# EAGLE design IN17BOARD_Control (EAGLE 7.1.0)
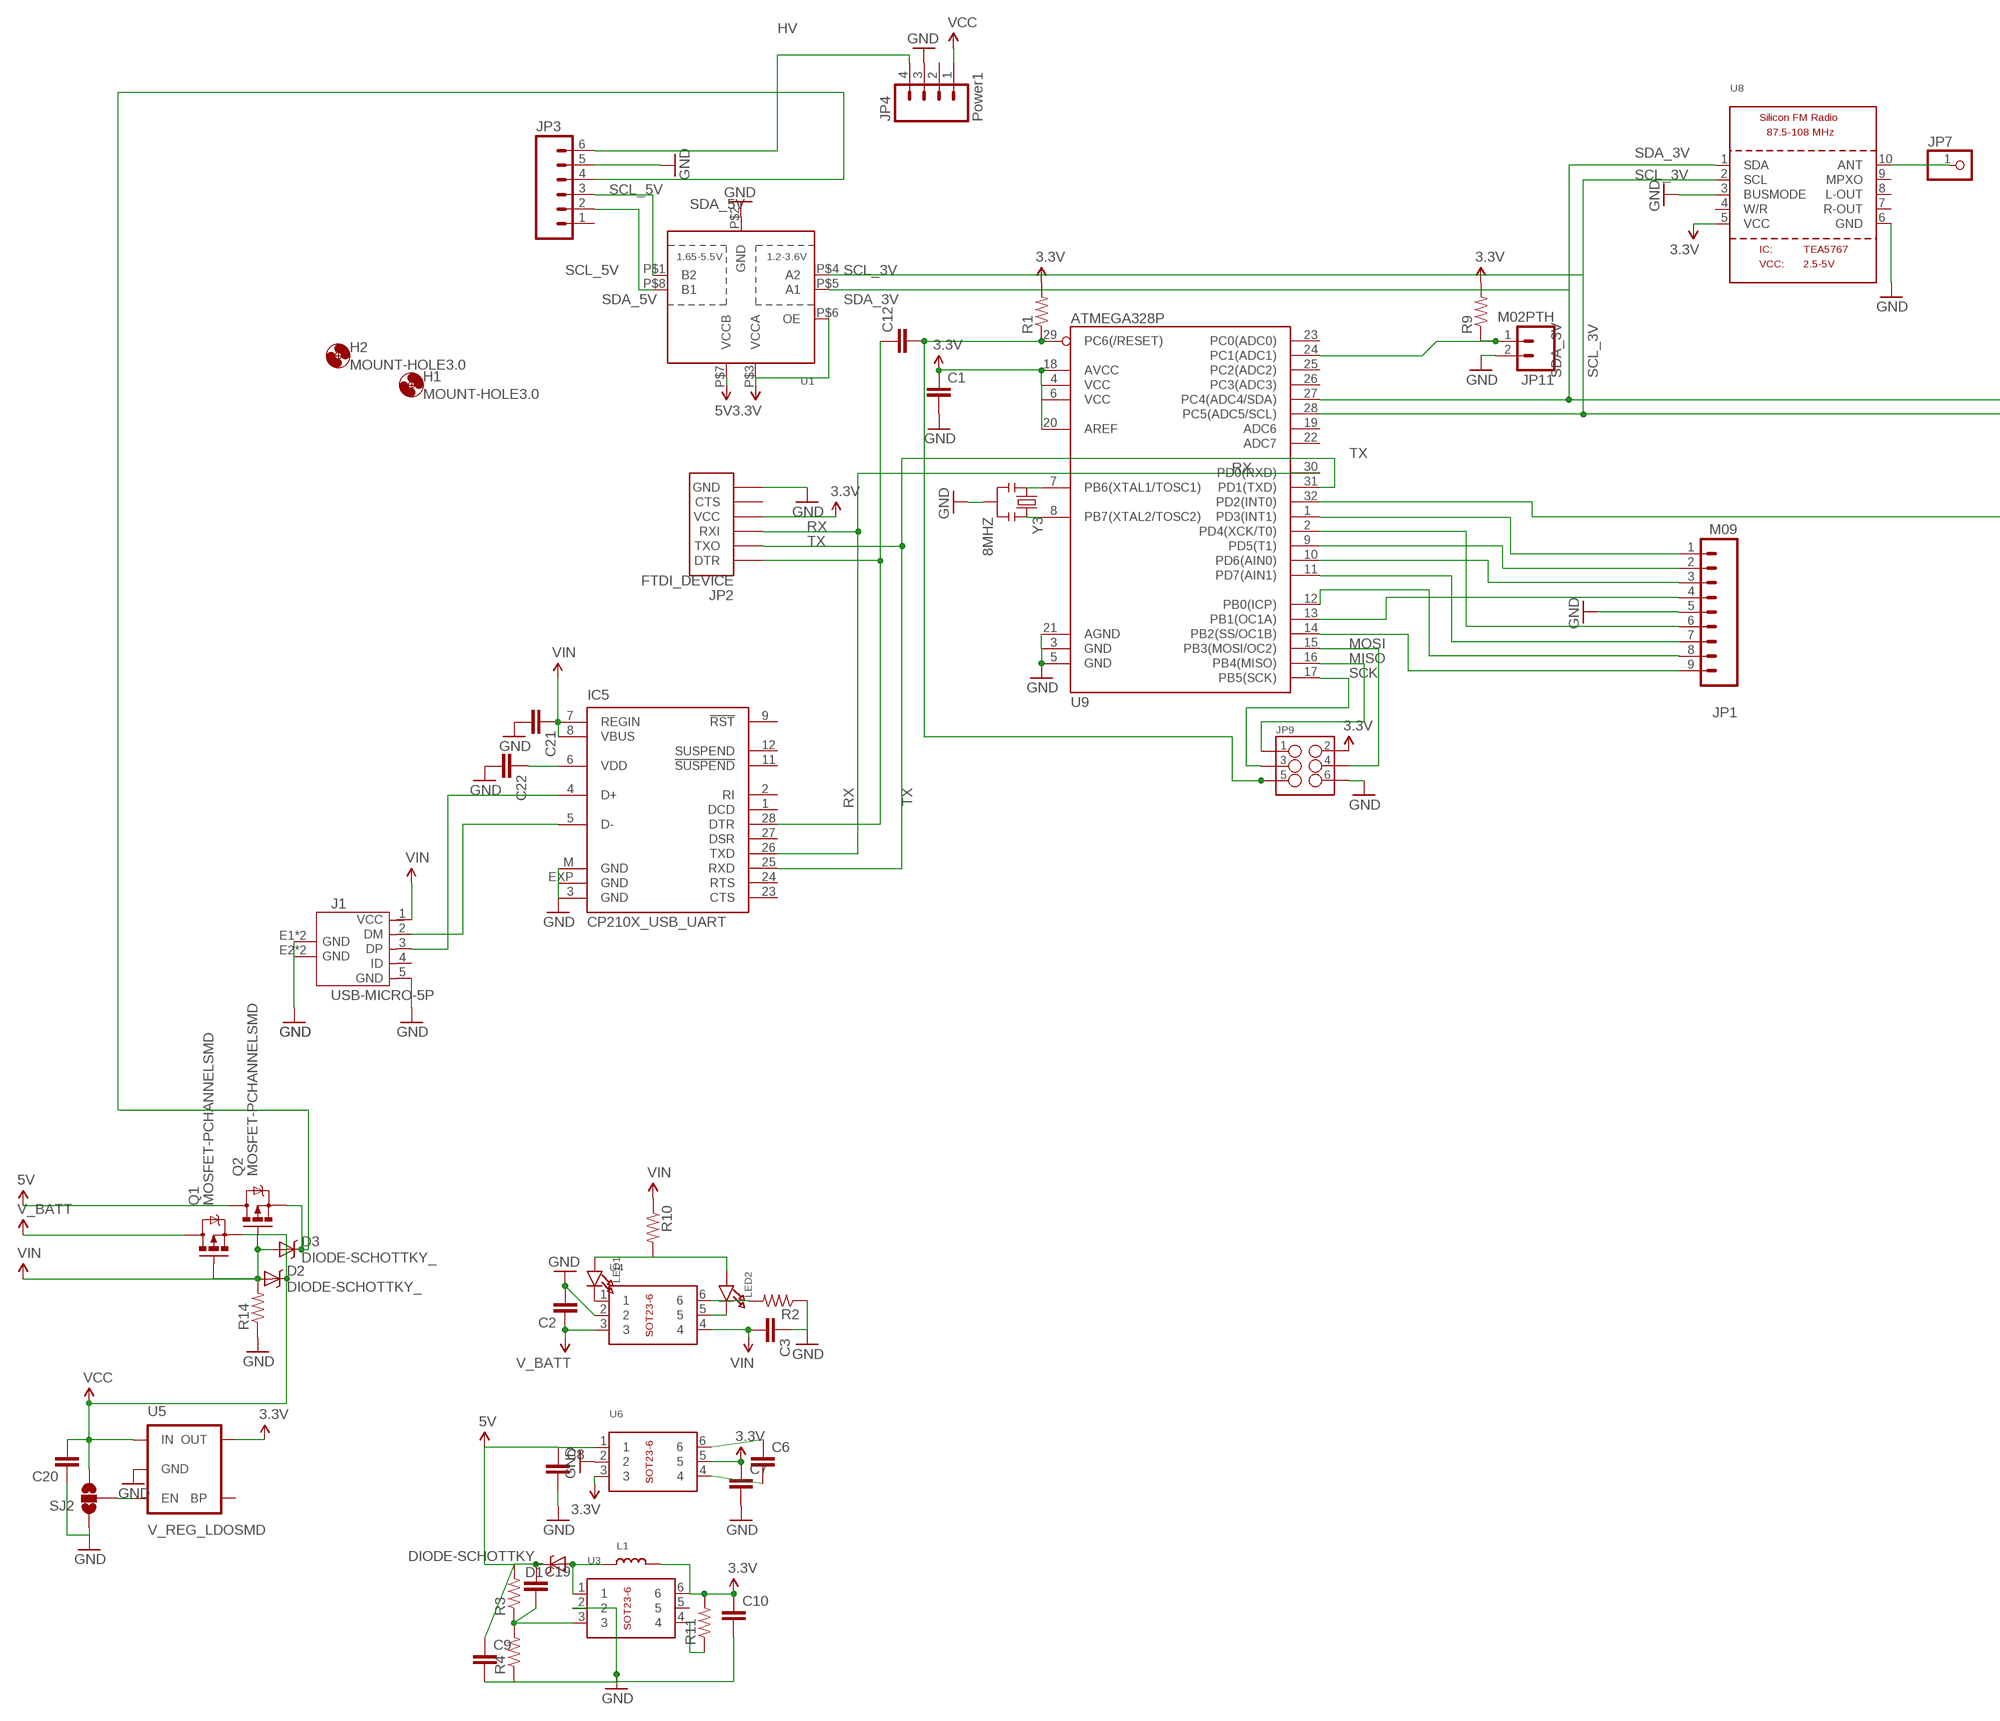
[diagram p0: schematic, sheet 1, part 1 of 2]
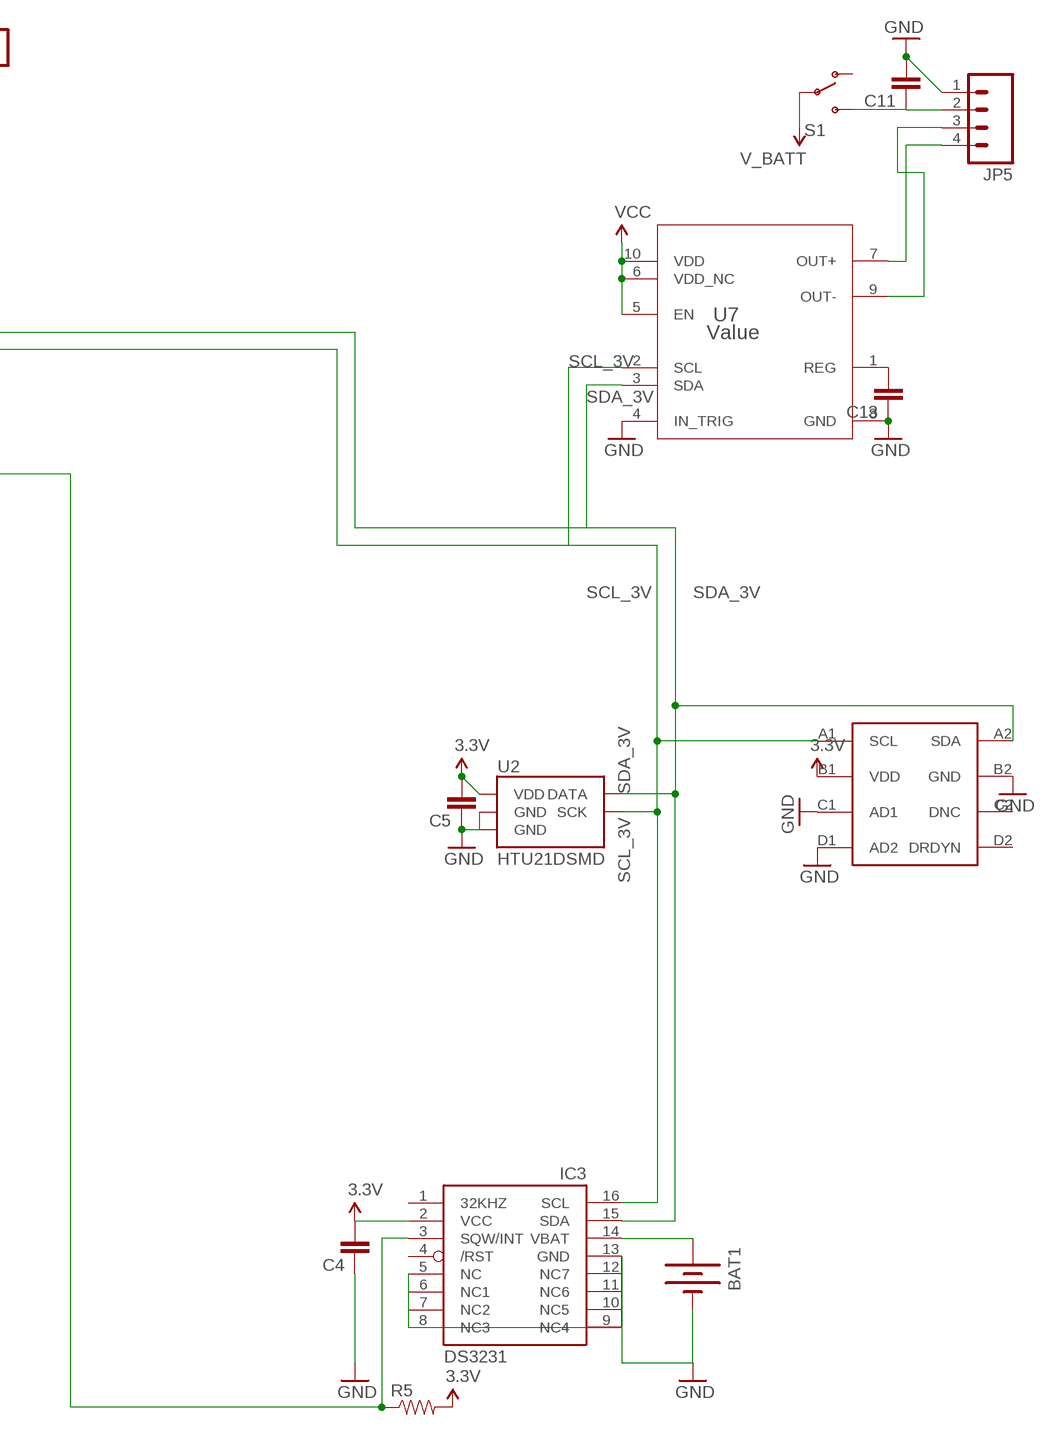
[diagram p1: schematic, sheet 1, part 2 of 2]

## Parts
BAT1  BATTERY12PTH  [BATTCON_12MM_PTH]
C1  CAP0805  [0805]
C2  CAP0805  [0805]
C3  CAP0805  [0805]
C4  CAP0805  [0805]
C5  CAP0805  [0805]
C6  CAP0805  [0805]
C7  CAP0805  [0805]
C8  CAP0805  [0805]
C9  CAP0805  [0805]
C10  CAP0805  [0805]
C11  CAP0805  [0805]
C12  CAP0805  [0805]
C13  CAP0805  [0805]
C19  CAP0805  [0805]
C20  CAP0805  [0805]
C21  CAP0805  [0805]
C22  CAP0805  [0805]
D1  DIODE-SCHOTTKY_  [SMA-DIODE]
D2  DIODE-SCHOTTKY_  [SMA-DIODE]
D3  DIODE-SCHOTTKY_  [SMA-DIODE]
H1  MOUNT-HOLE3.0  [3,0]
H2  MOUNT-HOLE3.0  [3,0]
IC3  DS3231/SO  [SO16W]
IC5  CP210X_USB_UART  [MLP28]
J1  USB-MICRO-5P  [MICRO-USB-5P]
JP1  M09  [1X09]
JP2  FTDI_DEVICE  [FTDI_DEVICE_SIDE]
JP3  M06SIP  [1X06]
JP4  Power1  M04LOCK  [1X04_LOCK]
JP5  M041.27MM  [1X04-1.27MM]
JP7  HEADER-1X1ROUND  [1X01_ROUND]
JP9  M03X22X3_SILK_SM  [2X3]
JP11  M02PTH  [1X02]
L1  INDUCTOR  [INDUCTOR_1007]
LED1  LED0603_NOOUTLINE  [CHIPLED_0603_NOOUTLINE]
LED2  LED0603_NOOUTLINE  [CHIPLED_0603_NOOUTLINE]
Q1  MOSFET-PCHANNELSMD  [SOT23-3]
Q2  MOSFET-PCHANNELSMD  [SOT23-3]
R1  RESISTOR0805-RES  [0805]
R2  RESISTOR0805-RES  [0805]
R3  RESISTOR0805-RES  [0805]
R4  RESISTOR0805-RES  [0805]
R5  RESISTOR0805-RES  [0805]
R9  RESISTOR0805-RES  [0805]
R10  RESISTOR0805-RES  [0805]
R11  RESISTOR0805-RES  [0805]
R14  RESISTOR0805-RES  [0805]
S1  SWITCH-SPDT-SMD-A  [SWITCH-SPST-SMD-A]
SJ2  SOLDERJUMPER_2WAYS  [SJ_3]
U1  TXS0102  [VFSOP-8]
U2  HTU21DSMD  [HTU21D]
U3  BREAKOUT_SOT23-6  [BREAKOUT_SOT23-6]
U4  BREAKOUT_SOT23-6  [BREAKOUT_SOT23-6]
U5  V_REG_LDOSMD  [SOT23-5]
U6  BREAKOUT_SOT23-6  [BREAKOUT_SOT23-6]
U7  Value  DRV2604LDGSR  [DGS0010A]
U8  TEA5767MODULE  [TEA5767MODULE]
U9  ATMEGA328P  ATMEGA328_SMT  [TQFP32-08]
U$1  HDC1000  [BGA]
Y3  8MHZ  RESONATOR8MHZ  [RESONATOR-SMD]

## Nets
3.3V [Power]: C1.1 C4.2 C5.2 C7.1 C10.1 C22.1 IC3.2(VCC) IC5.6(VDD) JP2.P$4(VCC) JP9.2 L1.P$2 R1.2 R5.2 R9.2 R11.2 U1.P$3(VCCA) U1.P$6(OE) U2.VDD U3.6 U5.5(OUT) U6.3 U6.5 U8.5(VCC) U9.4(VCC) U9.6(VCC) U9.18(AVCC) U9.20(AREF) U$1.B1(VDD)
5V [Power]: C8.1 C9.1 C19.1 D1.C Q2.3(D) R3.2 U1.P$7(VCCB) U6.1
GND [Power]: BAT1.GND(-) C1.2 C2.2 C3.1 C4.1 C5.1 C7.2 C8.2 C9.2 C10.2 C11.2 C13.1 C20.1 C21.2 C22.2 IC3.5(NC) IC3.6(NC1) IC3.7(NC2) IC3.8(NC3) IC3.9(NC4) IC3.10(NC5) IC3.11(NC6) IC3.12(NC7) IC3.13(GND) IC5.3(GND) IC5.EXP(GND) IC5.M(GND) J1.5(GND) J1.E1(GND) J1.E2(GND) J1.P1(GND) J1.P2(GND) JP1.5 JP2.P$6(GND) JP3.5 JP4.3 JP5.1 JP9.6 JP11.2 R2.1 R4.1 R14.1 SJ2.1 U1.P$2(GND) U2.7(GND) U2.GND U3.2 U4.2 U5.2(GND) U6.2 U7.4(IN_TRIG) U7.8(GND) U8.3(BUSMODE) U8.6(GND) U9.3(GND) U9.5(GND) U9.21(AGND) U$1.B2(GND) U$1.C1(AD1) U$1.D1(AD2) Y3.2
HV [Power]: JP3.6 JP4.4
MISO: JP9.1 U9.16(PB4(MISO))
MOSI: JP9.4 U9.15(PB3(MOSI/OC2))
N$1: C12.1 IC5.28(DTR) JP2.P$1(DTR)
N$2: U9.8(PB7(XTAL2/TOSC2)) Y3.3
N$3: U9.7(PB6(XTAL1/TOSC1)) Y3.1
N$4 [Power]: C11.1 JP5.2 S1.3(S)
N$5: BAT1.VCC@1(+) IC3.14(VBAT)
N$6: C12.2 JP9.5 R1.1 U9.29(PC6(/RESET))
N$7: R2.2 U4.6
N$8: IC3.3(SQW/INT) R5.1 U9.32(PD2(INT0))
N$9: SJ2.2 U5.3(EN)
N$10: LED1.A LED2.A R10.2
N$11: JP11.1 R9.1 U9.24(PC1(ADC1))
N$12: JP1.1 U9.1(PD3(INT1))
N$13: JP1.2 U9.9(PD5(T1))
N$14: JP1.3 U9.10(PD6(AIN0))
N$15: JP1.4 U9.13(PB1(OC1A))
N$16: C13.2 U7.1(REG)
N$17: JP5.3 U7.9(OUT-)
N$18: IC5.4(D+) J1.3(DP)
N$19: JP1.6 U9.2(PD4(XCK/T0))
N$20: JP1.7 U9.11(PD7(AIN1))
N$21: JP1.8 U9.12(PB0(ICP))
N$22: JP1.9 U9.14(PB2(SS/OC1B))
N$23: JP7.1 U8.10(ANT)
N$26: IC5.5(D-) J1.2(DM)
N$30: JP5.4 U7.7(OUT+)
N$31: D1.A L1.P$1 U3.1
N$32: LED1.C U4.1
N$33: LED2.C U4.5
N$35: C6.2 U6.4
N$36: C6.1 U6.6
N$39: C19.2 R3.1 R4.2 U3.3
N$41: R11.1 U3.4
N$45 [Power]: D3.C JP3.4 Q2.2(S)
RX: IC5.26(TXD) JP2.P$3(RXI) U9.30(PD0(RXD))
SCK: JP9.3 U9.17(PB5(SCK))
SCL_3V: IC3.16(SCL) U1.P$4(A2) U2.SCK U7.2(SCL) U8.2(SCL) U9.28(PC5(ADC5/SCL)) U$1.A1(SCL)
SCL_5V: JP3.3 U1.P$1(B2)
SDA_3V: IC3.15(SDA) U1.P$5(A1) U2.DATA U7.3(SDA) U8.1(SDA) U9.27(PC4(ADC4/SDA)) U$1.A2(SDA)
SDA_5V: JP3.2 U1.P$8(B1)
TX: IC5.25(RXD) JP2.P$2(TXO) U9.31(PD1(TXD))
V_BATT [Power]: C2.1 Q1.3(D) S1.2(P) U4.3
VCC [Power]: C20.2 D2.C JP4.1 Q1.2(S) SJ2.3 U5.1(IN) U7.5(EN) U7.6(VDD_NC) U7.10(VDD)
VIN: C3.2 C21.1 D2.A D3.A IC5.7(REGIN) IC5.8(VBUS) J1.1(VCC) Q1.1(G) Q2.1(G) R10.1 R14.2 U4.4
Unconnected: IC3.1(32KHZ) IC3.4(/RST) IC5.1(DCD) IC5.2(RI) IC5.9(!RST) IC5.11(!SUSPEND) IC5.12(SUSPEND) IC5.23(CTS) IC5.24(RTS) IC5.27(DSR) J1.4(ID) JP2.P$5(CTS) JP3.1 JP4.2 S1.1(O) U3.5 U5.4(BP) U8.4(W/R) U8.7(R-OUT) U8.8(L-OUT) U8.9(MPXO) U9.19(ADC6) U9.22(ADC7) U9.23(PC0(ADC0)) U9.25(PC2(ADC2)) U9.26(PC3(ADC3)) U$1.C2(DNC) U$1.D2(DRDYN)

## Library data of the parts
BAT1 = SparkFun-Electromechanical:BATTERY: Battery Holders Various common sizes : AA, AAA, 20mm coin cell and 12mm coin cell. 20MM_4LEGS, BATT-10373
C1-C8 C11-C13 C20-C22 = SparkFun-Capacitors:CAP: Capacitor Standard 0603 ceramic capacitor, and 0.1" leaded capacitor.
C9 C10 C19 = SparkFun-Passives:CAP: Capacitor Standard 0603 ceramic capacitor, and 0.1" leaded capacitor.
D1-D3 = SparkFun-DiscreteSemi:DIODE-SCHOTTKY: Commonly MBRA140.
H1 H2 = holes:MOUNT-HOLE: MOUNTING HOLE with drill center marker
IC3 = adafruit2:DS3231
IC5 = SparkFun-DigitalIC:CP210X_USB_UART: Single-Chip USB to UART Bridge Source: www.silabs.com .. CP2101.pdf / cp2102.pdf. Spark Fun Electronics SKU : COM-00310
J1 = Connector :USB-MICRO-5P
JP1 = SparkFun-Connectors:M09: Header 9 Standard 9-pin 0.1" header. Use with straight break away headers (SKU : PRT-00116), right angle break away headers (PRT-00553), swiss pins (PRT-00743), machine pins (PRT-00117), and female headers (PRT-00115).
JP2 = SparkFun-Connectors:FTDI_DEVICE: Connector which mates to FTDI basic or FTDI cable.
JP3 = SparkFun-Connectors:M06: Header 6 Standard 6-pin 0.1" header. Use with straight break away headers (SKU : PRT-00116), right angle break away headers (PRT-00553), swiss pins (PRT-00743), machine pins (PRT-00117), and female headers (PRT-00115). Molex polarized connector foot print use with SKU : PRT-08094 with associated crimp pins and housings. NOTES ON THE VARIANTS LOCK and LOCK_LONGPADS... This footprint was designed to help hold the alignment of a through-hole component (i.e. 6-pin header) while soldering it into place. You may notice that each hole has been shifted either up or down by 0.005 of an inch from it's more standard position (which is a perfectly straight line). This slight alteration caused the pins (the squares in the middle) to touch the edges of the holes. Because they are alternating, it causes a "brace" to hold the component in place. 0.005 has proven to be the perfect amount of "off-center" position when using our standard breakaway headers. Although looks a little odd when you look at the bare footprint, once you have a header in there, the alteration is very hard to notice. Also,if you push a header all the way into place, it is covered up entirely on the bottom side. This idea of altering the position of holes to aid alignment will be further integrated into the Sparkfun Library for other footprints. It can help hold any component with 3 or more connection pins.
JP4 JP5 = SparkFun-Connectors:M04: Header 4 Standard 4-pin 0.1" header. Use with straight break away headers (SKU : PRT-00116), right angle break away headers (PRT-00553), swiss pins (PRT-00743), machine pins (PRT-00117), and female headers (PRT-00115). Molex polarized connector foot print use with SKU : PRT-08231 with associated crimp pins and housings. 1MM SMD Version SKU: PRT-10208
JP7 = microbuilder:HEADER-1X1: PIN HEADER
JP9 = SparkFun-Connectors:M03X2: 2x3 .1" header. Shrouded, with keying- CONN-10681 SMT- CONN-11415 Pogo pins- HW-11044
JP11 = SparkFun-Connectors:M02: Standard 2-pin 0.1" header. Use with - straight break away headers ( PRT-00116) - right angle break away headers (PRT-00553) - swiss pins (PRT-00743) - machine pins (PRT-00117) - female headers (PRT-00115) Molex polarized connector foot print use with: PRT-08233 with associated crimp pins and housings. 2.54_SCREWTERM for use with PRT-10571. 3.5mm Screw Terminal footprints for PRT-08084 5mm Screw Terminal footprints for use with PRT-08433
L1 = microbuilder:INDUCTOR: Inductors 0603: 10nH Ceramic Inductor - microwire antenna/RF (Digikey: 712-1434-2-ND) 0805: 560nH Ceramic Inductor - RF (Digikey: 553-1047-1-ND) 270nH Ceramic Inductor - Q = 40@250MHz, +-5%, 1 Ohm DC Resistance (Digikey: 535-10506-2-ND) 1007 (2518 Metric) SMT: 10µH 10% 250mOhm 820mA 1007 Inductor (Digikey: 587-2189-1-ND) 22µH 10% 500mOhm 580mA 1007 Inductor (Digikey: 587-2190-1-ND) 47µH 10% 950mOhm 420mA 1007 Inductor (Digikey: 587-2191-1-ND) 47µH 5% 100mOhm 1A 1008 Inductor (Digikey: 732-1816-1-ND) 5.0x5.0mm (Taiyo Yuden NR5040 Series) 6.8µH 20% 2.3A 64mOhm Inductor (Digikey: 587-2374-2-ND) 5.0x5.0mm (TDK VLC5045 Series) 4.7µH 20% 3.3A 34mOhm Inductor (Digikey: 445-6526-1-ND) 6.8µH 20% 2.7A 46mOhm Inductor (Digikey: 445-6527-1-ND) 6.0x6.0mm (TDK VLC6045 Series) 4.7µH 20% 3.8A 27mOhm Inductor (Digikey: 445-6538-2-ND) 6.8µH 20% 3A 41mOhm Inductor (Digikey: 445-6540-1-ND) 6.2µH 30% 2.2A 45mOhm Inductor (Digikey: SRR5028-6R2YCT-ND) - Not TDK VLC6045 but footprint should match 6.0x6.0mm (TDK SLF6045 Series) 6.8uH 30% 2A 33mOhm Inductor (Digikey: 445-4572-1-ND, Mouser: 810-SLF645T6R8N2R0PF)
LED1 LED2 = microbuilder:LED: LED 0603 - 0603 Surface Mount Package 2mA: Green LED - Low Power (3.9mcd, 2ma, 1.7Vf) - Digikey: 475-2709-2-ND Orange LED - Low Power (9.8mcd, 2ma, 1.8Vf) - Digikey: 475-1194-2-ND Red LED - Low Power (5mcd, 2ma, 1.8Vf) - Digikey: 475-1195-2-ND Yellow LED - Low Power (7mcd, 2ma, 1.8Vf) - Digikey: 475-1196-2-ND 5mA: Blue LED - Low Power (17mcd, 5ma, 2.9Vf) - Digikey: LNJ937W8CRACT-ND 0805 - 0805 Surface Mount Package 2mA: Red LED (8.8mcd, 2mA, 1.8Vf, Clear) - Low Power [Digikey: 475-2510-1-ND] Green LED (5mcd, 2mA, 1.8Vf, Clear) - Low Power [Digikey: 475-2730-1-ND] Yellow LED (11.3mcd, 2mA, 1.8Vf, Clear) - Low Power [Digikey: 475-2555-1-ND] 20mA: Red LED (104mcd, 20mA, Diffused) - LS R976 [Digikey: 475-1278-6-ND] Red LED (12mcd, 20mA, 2.0Vf, Clear) - APT2012EC [Digikey: 754-1128-1-ND] Green LED (15mcd, 20mA, 2.2Vf, Clear) - APT2012GC [Digikey: 754-1131-1-ND] Orange LED (160mcd, 20mA, 2.1Vf, Clear) - APT2012SECK [Digikey: 754-1130-1-ND] 1206 - 1206 Surface Mount Package Green LED (26mcd, 20mA, Diffused) - LG N971 [Digikey: 475-1407-6-ND] Red LED (15mcd, 20mA, Diffused) - LH N974 [Digikey: 475-1416-6-ND]
Q1 Q2 = SparkFun-DiscreteSemi:MOSFET-PCHANNEL: Generic PMOSFET
R1-R5 R9-R11 R14 = SparkFun-Resistors:RESISTOR: Resistor Basic schematic elements and footprints for 0603, 1206, and PTH resistors.
S1 = SparkFun-Electromechanical:SWITCH-SPDT: SPDT Switch Simple slide switch, Spark Fun Electronics SKU : COM-00102 DPDT SMT slide switch, AYZ0202, SWCH-08179
SJ2 = SparkFun-Passives:SOLDERJUMPER_2WAY: Solder Jumper 2 way solder jumper
U1 = adafruit2:TXS0102: 2-Bit Bi-Directional Level Shifter (I2C, etc.) Designed for I2C devices and has internal pullups. Not to be confused with TXB010x series. 1.2V-3.6V (VCCA) to 1.65V-5.5V (VCCB) bi-directional level shifter with auto direction sensing. Max data rate - 24Mbps (Push Pull), 2Mbps (Open Drain) Digikey: 296-21931-1-ND
U2 = SparkFun-Sensors:HTU21D
U3 U4 U6 = microbuilder:BREAKOUT_SOT23-6: IC Breakout SOT23-6
U5 = SparkFun-PowerIC:V_REG_LDO: Voltage Regulator LDO Standard 150mA LDO voltage regulator in SOT-23 layout. Micrel part MIC5205. BP (by-pass) pin is used to lower output noise with 470pF cap.
U7 = DRV2605l:DRV2604LDGSR; COMPTYPE: IC; MANUFACTURER: Texas Instruments; MOUNTTYPE: SMT; PACKAGEREFERENCE: DGS0010A; PARTNUMBER: DRV2604LDGS; PIN_COUNT: 10; REFDES: RefDes; ROHS: Y; TYPE: TYPE
U8 = microbuilder:TEA5767MODULE: TEA5767 FM-Receiver Module - 87.5-108MHz
U9 = SparkFun-DigitalIC:ATMEGA328_SMT: 32-Pin Atmega328 part Commonly used on Arduino compatible boards Available in QFP and QFN packages TQFP is IC-09069 QFN is non-stock; PROD_ID: IC-09069
U$1 = untitled:HDC1000
Y3 = SparkFun-FreqCtrl:RESONATOR: Resonator Small SMD resonator. Used, eg, on the Arduino Pro/ Pro Mini boards. 8MHz- XTAL-08895 16MHz- XTAL-08900; PROD_ID: XTAL-08895

## Net classes
0 default: width 0.254 mm
1 Power: width 0.254 mm

## Board
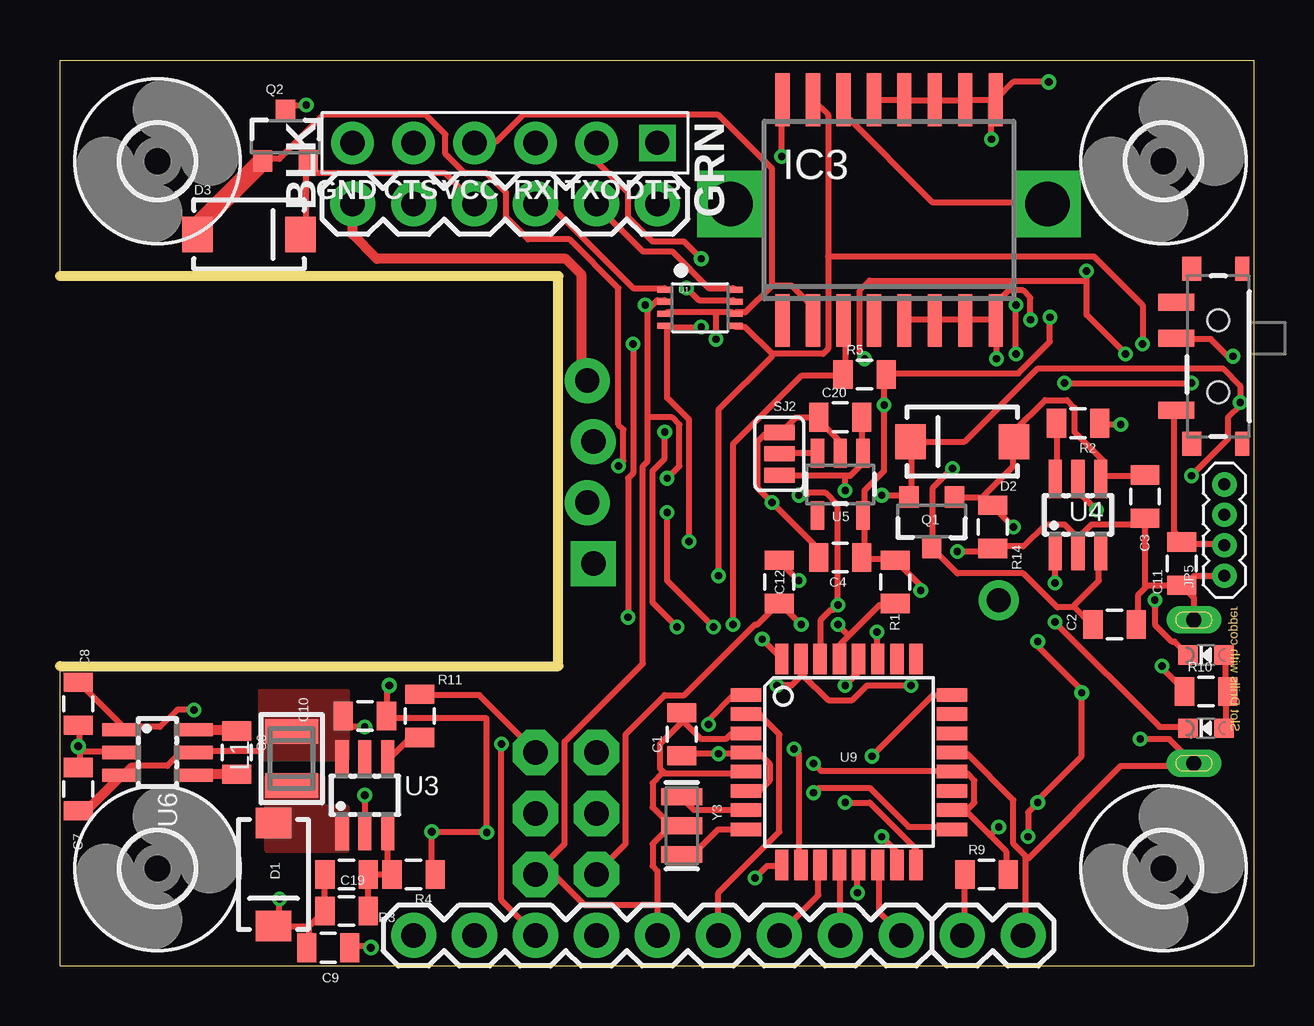
[diagram p2: board, top side]
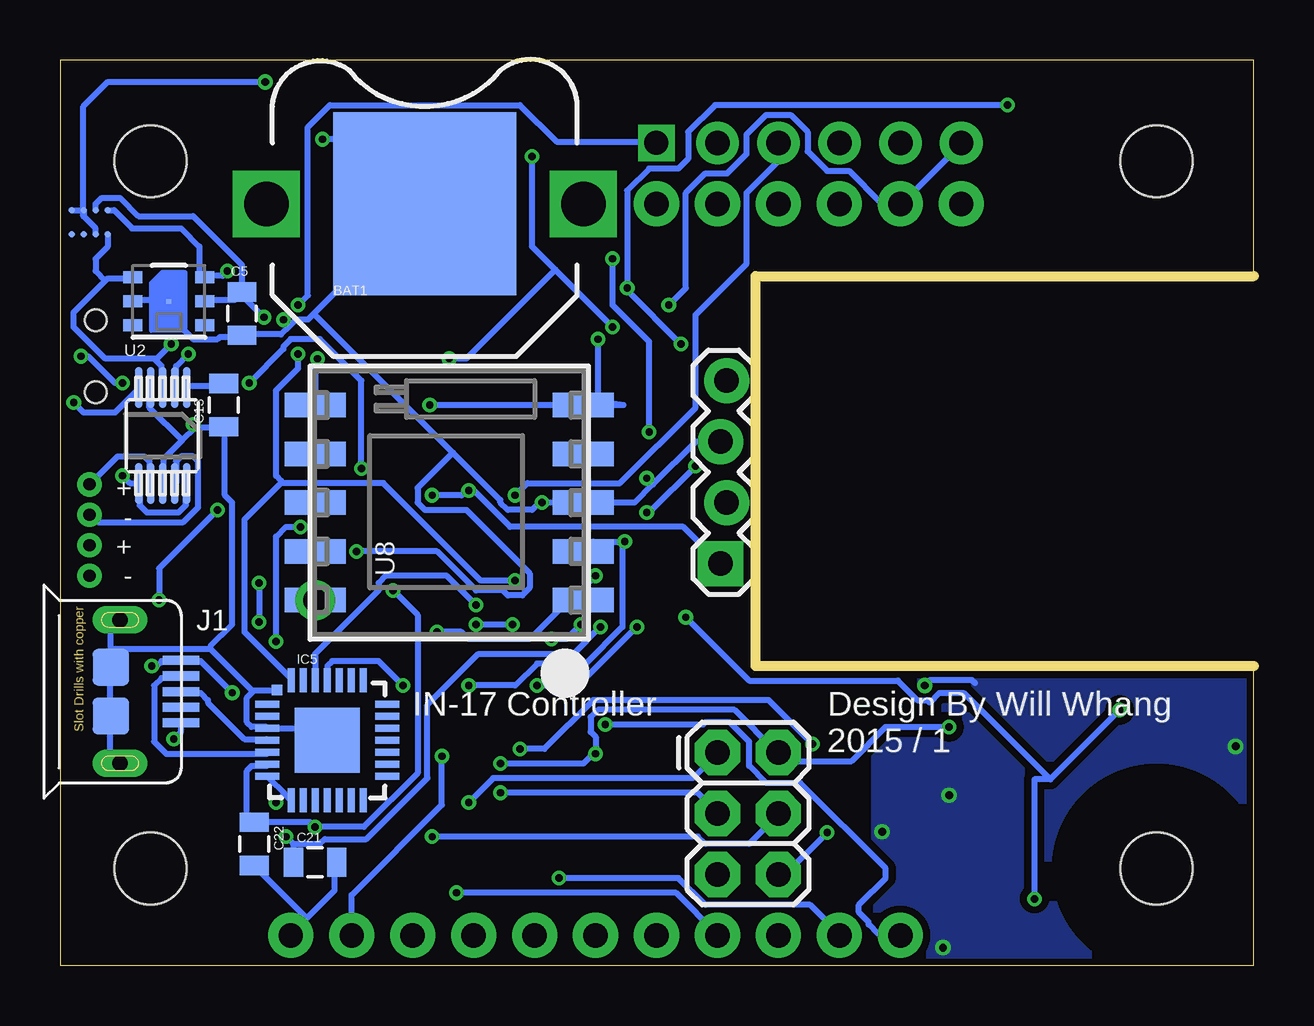
[diagram p3: board, bottom side, seen from below]

Size 49.75 x 37.75 mm. Coordinates in mm from the lower left corner, seen from the top.
Outline: 0,0 0,12.49 20.76,12.49 20.76,28.75 0,28.75 0,37.75 49.75,37.75 49.75,0 0,0
Copper layers (1*16): Top 0.035mm / dielectric 1.5mm / Bottom 0.035mm
Design rules "SeeedStudio_2layer_DRU_no_angle_20140221": minimum track width 6mil, minimum drill 12mil, track to track 6mil, track to pad 6mil, pad to pad 6mil, via to via 6mil, smd to smd 0mil, copper to edge 10mil, drill to drill 10mil, minimum pad ring 10mil, minimum via ring 6mil, stop-mask expansion 2mil, vias tented up to drill 100mil, thermal gap 10mil

### Footprints (pad centres in the part's own frame; a part is rotated, then mirrored left to right if it is on the bottom)
BATTCON_12MM_PTH = smd 7.62 x 7.62: GND 0,0 | drill 1.854 square: VCC@1 -6.604,0; VCC@2 6.604,0
0805 = smd 0.8 x 1.2: 1 -0.9,0; 2 0.9,0
SMA-DIODE = smd 1.27 x 1.47: A -2.15,0; C 2.15,0
3,0 = hole 3: 0,0
SO16W = smd 0.6 x 2.2: 1 -4.445,-4.6; 2 -3.175,-4.6; 3 -1.905,-4.6; 4 -0.635,-4.6; 5 0.635,-4.6; 6 1.905,-4.6; 7 3.175,-4.6; 8 4.445,-4.6; 9 4.445,4.6; 10 3.175,4.6; 11 1.905,4.6; 12 0.635,4.6; 13 -0.635,4.6; 14 -1.905,4.6; 15 -3.175,4.6; 16 -4.445,4.6
MLP28 = smd 1 x 0.3: 1 -2.5,1.5; 2 -2.5,1; 3 -2.5,0.5; 4 -2.5,0; 5 -2.5,-0.5; 6 -2.5,-1; 7 -2.5,-1.5; 15 2.5,-1.5; 16 2.5,-1; 17 2.5,-0.5; 18 2.5,0; 19 2.5,0.5; 20 2.5,1; 21 2.5,1.5 | smd 0.3 x 1: 8 -1.5,-2.5; 9 -1,-2.5; 10 -0.5,-2.5; 11 0,-2.5; 12 0.5,-2.5; 13 1,-2.5; 14 1.5,-2.5; 22 1.5,2.5; 23 1,2.5; 24 0.5,2.5; 25 0,2.5; 26 -0.5,2.5; 27 -1,2.5; 28 -1.5,2.5 | smd 2.7 x 2.7: EXP 0,0 | smd 0.435 x 0.435: M -2.103,2.103
MICRO-USB-5P = smd 0.38 x 1.52: 1 -1.3,0; 2 -0.65,0; 3 0,0; 4 0.65,0; 5 1.3,0 | smd 1.524 x 1.524: E1 -1.016,-2.921; E2 1.016,-2.921 | drill 0.635 pad 1.143 long: P1 -2.985,-2.54; P2 2.985,-2.54
1X09 = drill 1.016 pad 1.88: 1 0,0; 2 2.54,0; 3 5.08,0; 4 7.62,0; 5 10.16,0; 6 12.7,0; 7 15.24,0; 8 17.78,0; 9 20.32,0
FTDI_DEVICE_SIDE = drill 1 square: P$1 -6.35,0 | drill 1.016 pad 1.778: P$2 -3.81,0; P$3 -1.27,0; P$4 1.27,0; P$5 3.81,0; P$6 6.35,0
1X06 = drill 1.016 pad 1.88: 1 0,0; 2 2.54,0; 3 5.08,0; 4 7.62,0; 5 10.16,0; 6 12.7,0
1X04_LOCK = drill 1.016 pad 1.88 square: 1 0,0.127 | drill 1.016 pad 1.88: 2 2.54,-0.127; 3 5.08,0.127; 4 7.62,-0.127
1X04-1.27MM = drill 0.508 pad 1: 1 0,0; 2 1.27,0; 3 2.54,0; 4 3.81,0
1X01_ROUND = drill 1 pad 1.676: 1 0,0
2X3 = drill 1.016 pad 1.88 octagon: 1 0,0; 2 0,2.54; 3 2.54,0; 4 2.54,2.54; 5 5.08,0; 6 5.08,2.54
1X02 = drill 1.016 pad 1.88: 1 0,0; 2 2.54,0
INDUCTOR_1007 = smd 1.016 x 2.2: P$1 -1.127,0; P$2 1.127,0
CHIPLED_0603_NOOUTLINE = smd 0.8 x 0.8: A 0,-0.75; C 0,0.75
SOT23-3 = smd 0.8 x 0.9: 1 -0.95,-1; 2 0.95,-1; 3 0,1.1
SWITCH-SPST-SMD-A = smd 0.7 x 1.5: 1 -2.25,-1.75; 2 -0.75,-1.75; 3 2.25,-1.75 | smd 1 x 0.6: GND1 -3.65,1; GND3 3.65,1 | smd 1 x 0.8: GND2 -3.65,-1.1; GND4 3.65,-1.1 | hole 0.9: -1.5,0; 1.5,0
SJ_3 = smd 0.635 x 1.27: 1 -0.889,0; 2 0,0; 3 0.889,0
VFSOP-8 = smd 0.25 x 0.65: P$1 -0.75,-1.45; P$2 -0.25,-1.45; P$3 0.25,-1.45; P$4 0.75,-1.45; P$5 0.75,1.45; P$6 0.25,1.45; P$7 -0.25,1.45; P$8 -0.75,1.45
HTU21D = smd 0.2 x 0.2: 7 0,0 | smd 0.8 x 0.5: DATA 1.5,-1; GND 1.5,0; NC@1 -1.5,1; NC@6 1.5,1; SCK -1.5,-1; VDD -1.5,0
BREAKOUT_SOT23-6 = smd 0.55 x 1.6: 1 -0.95,-1.5; 2 0,-1.5; 3 0.95,-1.5; 4 0.95,1.5; 5 0,1.5; 6 -0.95,1.5
SOT23-5 = smd 0.55 x 1.2: 1 -0.95,-1.3; 2 0,-1.3; 3 0.95,-1.3; 4 0.95,1.3; 5 -0.95,1.3
DGS0010A = smd 1.702 x 0.305: 1 -2,1; 2 -2,0.5; 3 -2,0; 4 -2,-0.5; 5 -2,-1; 6 2,-1; 7 2,-0.5; 8 2,0; 9 2,0.5; 10 2,1
TEA5767MODULE = smd 1.016 x 2.54: 1 -4.064,-5.588; 2 -2.032,-5.588; 3 0,-5.588; 4 2.032,-5.588; 5 4.064,-5.588; 6 4.064,5.588; 7 2.032,5.588; 8 0,5.588; 9 -2.032,5.588; 10 -4.064,5.588
TQFP32-08 = smd 1.27 x 0.559: 1 -4.293,2.8; 2 -4.293,2; 3 -4.293,1.2; 4 -4.293,0.4; 5 -4.293,-0.4; 6 -4.293,-1.2; 7 -4.293,-2; 8 -4.293,-2.8; 17 4.293,-2.8; 18 4.293,-2; 19 4.293,-1.2; 20 4.293,-0.4; 21 4.293,0.4; 22 4.293,1.2; 23 4.293,2; 24 4.293,2.8 | smd 0.559 x 1.27: 9 -2.8,-4.293; 10 -2,-4.293; 11 -1.2,-4.293; 12 -0.4,-4.293; 13 0.4,-4.293; 14 1.2,-4.293; 15 2,-4.293; 16 2.8,-4.293; 25 2.8,4.293; 26 2,4.293; 27 1.2,4.293; 28 0.4,4.293; 29 -0.4,4.293; 30 -1.2,4.293; 31 -2,4.293; 32 -2.8,4.293
BGA = smd 0.275 x 0.275: A1 -0.5,0.5; A2 0.5,0.5; B1 -0.5,0; B2 0.5,0; C1 -0.5,-0.5; C2 0.5,-0.5; D1 -0.5,-1; D2 0.5,-1
RESONATOR-SMD = smd 0.7 x 1.7: 1 -1.2,0; 2 0,0; 3 1.2,0

### Placement (x,y rotation side)
BAT1  34.54,31.75 0 bottom
C1  25.91,9.65 90 top
C2  43.94,14.22 0 top
C3  45.21,19.56 90 top
C4  32.51,17.02 0 top
C5  42.16,27.18 90 bottom
C6  7.37,8.89 270 top
C7  0.76,7.37 90 top
C8  0.76,10.92 270 top
C9  11.18,0.76 0 top
C10  12.7,10.41 0 top
C11  46.74,16.76 270 top
C12  29.97,16 270 top
C13  42.93,23.37 90 bottom
C19  11.94,3.81 0 top
C20  32.51,22.86 0 top
C21  39.12,4.32 0 bottom
C22  41.66,5.08 270 bottom
D1  8.89,3.81 270 top
D2  37.59,21.84 180 top
D3  7.87,30.48 0 top
H1  4.06,33.53 0 top
H2  45.97,4.06 0 top
H3  MOUNT-HOLE3.0  [3,0]  4.06,4.06 0 top
H4  MOUNT-HOLE3.0  [3,0]  45.97,33.53 0 top
IC3  34.54,31.5 0 top
IC5  38.61,9.4 0 bottom
J1  44.7,11.43 270 bottom
JP1  14.73,1.27 0 top
JP2  18.54,34.29 180 top
JP3  24.89,31.75 180 top
JP4  22.1,16.76 90 bottom
JP5  48.51,16.26 90 top
JP7  39.12,15.24 0 top
JP9  22.35,8.89 270 bottom
JP11  37.59,1.27 0 top
L1  9.65,8.64 90 top
LED1  47.75,9.91 90 top
LED2  47.75,12.95 90 top
Q1  36.32,18.54 180 top
Q2  9.4,34.54 0 top
R1  34.8,16 90 top
R2  42.42,22.61 180 top
R3  11.94,2.29 180 top
R4  14.73,3.81 180 top
R5  33.53,24.64 0 top
R9  38.61,3.81 0 top
R10  47.75,11.43 0 top
R11  14.99,10.41 90 top
R14  38.86,18.29 90 top
S1  48.26,25.4 270 top
SJ2  29.97,21.34 270 top
U1  26.67,27.43 270 top
U2  45.21,27.69 180 bottom
U3  12.7,7.11 0 top
U4  42.42,18.8 0 top
U5  32.51,20.07 180 top
U6  4.06,8.89 270 top
U7  45.47,22.1 270 bottom
U8  33.53,19.3 90 bottom
U9  32.87,8.49 0 top
U$1  48.26,30.99 270 bottom
Y3  25.91,5.84 270 top

### Tracks (layer width: path | path; a pad name or v marks a point on that pad's centre or on a via)
3.3V  (via drill 0.3)
  Top 0.254: U6.3 2.64,8.03 2.95,8.33 4.47,8.33 4.98,8.84 5.49,8.84 U6.5 5.59,8.94 8.38,8.94 | R11.2 15.04,11.28 17.48,11.28 19.81,8.94 JP9.2 | v12.7,9.96 11.99,9.96 C10.1 | 38.76,5.44 37.8,6.4 U9.18 37.8,6.5 38.1,6.81 38.1,7.72 37.8,8.03 37.19,8.03 U9.20 37.08,8.13 31.7,8.13 v31.39,8.43 | 38.76,5.44 39.42,4.78 39.42,3.86 R9.2 | 38.76,5.44 v39.12,5.79 | C1.1 25.91,8.84 v27.43,8.84 28.55,8.84 U9.4 28.65,8.84 29.16,8.84 29.57,8.43 29.57,7.72 29.16,7.32 28.65,7.32 U9.6 | v41.25,27.03 41.25,26.01 39.93,24.69 34.54,24.69 R5.2 34.34,24.59 v34.34,23.37 34.34,20.62 33.53,19.81 33.53,18.8 U5.5 33.53,18.69 33.53,17.07 C4.2 33.43,16.97 34.75,16.97 R1.2 34.85,16.87 35.87,15.85 v35.87,15.65 | 27.33,27.23 28.04,27.23 U1.P$6 28.14,27.23 28.55,27.23 29.67,28.35 | 27.33,27.23 25.3,27.23 U1.P$3 | 29.67,28.35 30.48,28.35 31.29,27.53 31.29,26.92 IC3.2 | 27.33,27.23 v27.33,26.11 | 29.67,28.35 29.67,33.22 27.43,35.46 19.3,35.46 18.19,34.34 17.27,34.34 JP2.P$4
  Top 0.406: C7.1 1.09,6.47 U6.3
  Bottom 0.254: U2.VDD 43.69,27.74 42.47,27.74 42.16,28.04 C5.2 | 27.74,23.57 26.26,23.37 U8.5 | IC5.6 41.15,8.33 41.76,8.33 41.96,8.13 41.96,6.3 41.66,5.99 C22.1 41.55,5.99 39.32,5.99 v39.12,5.79 37.08,5.79 34.85,8.03 34.85,14.63 v35.87,15.65 | v12.7,9.96 15.34,9.96 16.76,8.53 19.41,8.53 19.71,8.84 JP9.2 19.91,8.94 21.64,10.67 27.33,10.67 27.64,10.36 27.64,9.75 27.43,9.55 v27.43,8.84 27.53,8.84 27.94,8.43 v31.39,8.43 | v41.25,27.03 42.16,27.94 C5.2 | v27.33,26.11 27.33,23.57 U8.5 | U8.5 v34.34,23.37 | U$1.B1 48.26,31.75 48.01,32 47.24,32 46.48,31.24 44.2,31.24 42.16,29.21 C5.2
  pour Top (no thermals): 8.38,11.43 11.94,11.43 11.94,8.64 8.38,8.64
5V  (via drill 0.3)
  Top 0.254: 10.36,1.63 10.36,0.81 C9.1 | 10.36,1.63 10.97,2.23 R3.2 C19.1 | 10.36,1.63 8.94,1.63 D1.C 9.14,1.66 v9.14,2.79 | C8.1 0.81,11.79 2.64,9.96 U6.1 2.74,9.96 4.17,9.96 4.88,10.67 v5.59,10.67 | v26.11,28.25 26.62,27.74 28.04,27.74 U1.P$7 | v10.26,35.87 9.65,35.87 9.45,35.66 Q2.3 | v23.67,14.53 23.67,20.32 23.88,20.52 v23.88,25.91
  Bottom 0.254: 8.48,7.77 v5.59,10.67 | v10.26,35.87 22.45,35.87 23.57,34.75 23.57,33.63 23.98,33.22 25.2,33.22 26.11,32.31 v26.11,28.25 26.11,28.14 v23.88,25.91 | 8.48,7.77 12.09,11.38 13.11,11.38 13.51,10.97 13.61,11.07 14.02,11.07 14.83,11.89 21.03,11.89 v23.67,14.53 | 8.48,7.77 9.14,7.77 v9.14,2.79
GND  (via drill 0.3, 0.33)
  Top 0.254: IC3.5 35.26,26.92 36.37,26.92 IC3.6 36.47,26.92 37.69,26.92 IC3.7 37.8,26.92 38.91,26.92 IC3.8 | IC3.9 38.91,36.07 37.8,36.07 IC3.10 37.69,36.07 36.47,36.07 IC3.11 36.37,36.07 35.26,36.07 IC3.12 35.15,36.07 33.93,36.07 IC3.13 | v38.81,34.44 38.81,35.97 IC3.9 | C9.2 12.09,0.81 12.9,0.81 v12.95,0.76 | C7.2 0.81,8.33 0.81,9.14 v0.76,9.14 | C8.2 0.81,9.96 0.81,9.25 v0.76,9.14 | v13.72,11.68 13.61,11.58 13.61,10.46 C10.2 13.65,10.32 17.78,10.32 v17.78,5.56 17.78,5.59 v15.49,5.59 15.49,3.81 R4.1 | v12.7,7.11 U3.2 | U6.2 2.54,8.94 0.91,8.94 v0.76,9.14 | v45.01,9.45 46.23,9.45 47.24,8.43 | 40.23,4.47 40.23,1.42 40.13,1.32 JP11.2 | 40.23,4.47 40.23,4.57 39.73,5.08 39.73,6.91 37.8,8.84 37.19,8.84 U9.21 | 47.24,8.43 47.14,8.33 44.2,8.33 40.34,4.47 40.23,4.47 | 47.24,8.43 J1.P2 | U9.3 28.55,9.65 27.94,9.65 27.74,9.45 26.72,9.45 25.91,10.26 C1.2 25.91,10.16 24.99,9.25 24.99,8.23 25.2,8.03 | 25.2,8.03 28.55,8.03 U9.5 | 25.2,8.03 25.09,8.03 24.69,7.62 24.69,6.6 25.4,5.89 25.91,5.89 Y3.2 25.4,5.79 24.69,5.08 24.69,4.17 24.89,3.96 24.89,2.54 | 24.89,2.54 JP1.5 | 24.54,27.38 24.49,27.33 24.49,22.86 | 24.54,27.38 24.89,27.74 25.2,27.74 U1.P$2 | 24.49,22.86 24.49,21.03 24.28,20.83 24.28,12.6 21.03,9.35 21.03,5.08 19.81,3.86 JP9.6 20.22,4.17 21.84,2.54 24.89,2.54 | 24.54,27.38 v24.38,27.53 | v44.2,22.55 43.38,22.55 R2.1 | 45.26,15.8 45.31,15.85 C11.2 | 45.26,15.8 44.91,15.44 44.91,14.22 C2.2 | 45.26,15.8 45.21,15.85 C3.1 45.11,18.39 42.98,18.39 42.47,17.88 U4.2 42.37,17.37 42.37,17.88 41.86,18.39 41.05,18.39 40.13,17.48 38.91,17.48 R14.1 38.81,17.27 v37.39,17.27 | JP5.1 47.24,16.26 46.84,15.85 C11.2
  Top 0.254: J1.P1 47.24,15.34 46.84,15.75 C11.2 | v39.01,25.3 39.01,26.82 IC3.8 | v40.44,26.92 40.44,27.84 40.13,28.14 39.52,28.14 38.91,27.53 38.91,27.03 IC3.8 | C4.1 31.6,17.07 31.6,17.37 v29.67,19.3 29.06,19.91 29.06,21.84 29.36,22.15 29.97,22.15 SJ2.1 30.07,22.25 30.68,22.86 C20.1 31.6,22.76 32.51,21.84 U5.2 | 24.49,22.86 25.5,22.86 25.81,22.55 25.81,20.83 v25.3,20.32 | v41.2,36.83 39.72,36.83 IC3.9
  Bottom 0.254: IC5.EXP 38.61,9.65 39.12,9.65 39.12,9.9 IC5.3 41.15,9.96 41.76,9.96 41.96,10.16 41.96,11.18 41.66,11.48 | 47.62,8.83 J1.P2 47.65,8.94 47.65,10.36 J1.E2 47.65,10.46 47.65,12.39 J1.E1 47.62,13.21 | 47.62,13.21 47.62,14.03 J1.P1 | JP2.P$6 12.19,34.24 14.73,31.7 JP3.5 14.83,31.8 15.54,31.8 16.87,33.12 17.78,33.12 18.59,33.93 18.59,34.75 19.3,35.46 20.32,35.46 21.13,34.65 21.13,33.83 21.95,33.02 22.86,33.02 23.67,32.21 23.67,28.25 v24.38,27.53 | v38.81,34.44 37.19,34.44 34.54,31.8 BAT1.GND 34.65,31.7 39.17,27.18 | U2.GND 46.63,27.74 45.21,27.74 U2.7 45.11,27.64 45.11,27.03 44.2,26.11 43.18,26.11 43.08,26.21 42.16,26.21 C5.1 42.06,26.31 40.54,26.31 40.18,26.67 | 19.81,3.86 JP9.6 19.53,3.81 v17.78,5.56 | 39.47,1.98 40.13,1.32 JP11.2 | 39.47,1.98 38.3,3.15 38.3,4.27 C21.2 | 39.47,1.98 41.66,4.17 C22.2 | J1.5 44.7,9.75 v45.01,9.45 | 42.98,22.45 C13.1 | 44.09,22.45 43.08,22.45 C13.1 | 44.65,21.89 45.41,21.13 45.41,20.12 U7.8 | 44.65,21.89 44.09,22.45 | v44.2,22.55 44.09,22.55 44.09,22.45 | 44.65,21.89 46.02,23.27 46.02,24.08 U7.4 | 41.66,11.48 40.74,11.48 IC5.M | 43.48,13.21 41.76,11.48 41.66,11.48 | 47.62,13.21 43.48,13.21 | C13.1 42.88,22.35 42.88,19.61 42.57,19.3 42.57,14.22 43.48,13.31 43.48,13.21 | U8.6 39.12,25.2 v39.01,25.3 | 40.18,26.67 39.93,26.92 39.42,26.92 39.17,27.18 | 40.18,26.67 v40.44,26.92 | 25.04,20.07 23.27,21.84 JP4.3 | 25.04,20.07 25.81,19.3 U8.3 v29.67,19.3 29.77,19.3 30.07,19 31.09,19 31.39,19.3 31.39,19.41 33.38,21.39 | 33.38,21.39 39.17,27.18 | v37.39,17.27 34.04,17.27 32.41,15.65 31.29,15.65 31.09,15.44 30.48,15.44 30.18,15.75 30.18,16.36 32.82,19 34.54,19 34.85,19.3 34.85,19.91 33.38,21.39
  Bottom 0.254: 25.04,20.07 v25.3,20.32 | v13.72,11.68 13.49,11.91 11.75,11.91 11.62,11.79 | U$1.D1 U$1.C1 48.76,31.23 | 48.76,31.23 48.26,30.73 U$1.B2 | 48.76,31.23 48.77,31.24 48.77,35.81 47.75,36.83 v41.2,36.83
  pour Bottom (isolate 0.305): -1.52,13.72 -1.52,-2.29 4.32,-2.29 15.49,-2.29 15.75,-2.29 15.75,13.72
HV
  Top 0.406: JP3.6 12.19,30.48 13.21,29.46 21.08,29.46 21.72,28.83 21.72,24.64 JP4.4
MISO  (via drill 0.3)
  Top 0.254: v32.72,6.81 33.73,6.81 35.66,4.88 35.66,4.27 U9.16
  Bottom 0.254: v32.72,6.81 31.7,7.82 23.37,7.82 22.35,8.84 JP9.1
MOSI  (via drill 0.3)
  Top 0.254: v34.24,5.38 34.85,4.78 34.85,4.27 U9.15
  Bottom 0.254: v34.24,5.38 23.16,5.38 22.86,5.08 21.03,5.08 19.81,6.3 JP9.4
N$1  (via drill 0.3)
  Top 0.254: v30.79,16.05 29.97,16.87 C12.1 | v39.83,25.5 v39.83,27.53
  Bottom 0.254: 40.54,20.12 42.06,18.59 42.06,13.92 40.13,11.99 IC5.28 | 40.54,20.12 36.27,20.12 32.21,16.05 v30.79,16.05 | v39.83,27.53 39.42,27.94 39.42,34.95 38.51,35.87 30.58,35.87 29.06,34.34 24.89,34.34 JP2.P$1 | v39.83,25.5 39.83,24.89 40.74,23.98 40.74,20.42 40.54,20.22 40.54,20.12
N$2
  Top 0.254: U9.8 28.55,5.69 27.43,5.69 26.42,4.67 25.91,4.67 Y3.3
N$3
  Top 0.254: U9.7 28.55,6.5 26.42,6.5 25.91,7.01 Y3.1
N$4
  Top 0.254: JP5.2 48.46,17.58 46.74,17.58 C11.1 46.74,17.78 46.43,18.09 46.43,23.06 S1.3
N$5
  Top 0.254: IC3.14 32.72,36.07 32.72,35.46 36.37,31.8 41.15,31.8 BAT1.VCC@1
N$6  (via drill 0.3)
  Top 0.254: 32.87,13.77 32.51,13.41 32.51,12.8 U9.29 | 32.87,13.77 34.14,15.04 34.75,15.04 R1.1 | 29.97,15.14 C12.2 | C12.2 29.87,15.04 29.06,14.22 28.96,14.22 26.01,11.28 25.2,11.28 23.57,9.65 23.57,5.08 22.35,3.86 JP9.5 | v32.41,14.22 32.87,13.77 | v30.89,14.22 30.07,15.04 C12.2
  Bottom 0.254: v30.89,14.22 v32.41,14.22
N$7
  Top 0.254: R2.2 41.55,22.55 41.55,20.32 U4.6
N$8  (via drill 0.3)
  Top 0.254: IC3.3 32.72,26.82 32.72,24.69 R5.1 32.51,24.59 30.89,24.59 28.04,21.74 v28.04,14.22 | v29.26,13.61 30.07,12.8 U9.32
  Bottom 0.254: v29.26,13.61 28.65,13.61 v28.04,14.22
N$9
  Top 0.254: U5.3 31.55,21.39 30.02,21.39 SJ2.2
N$10
  Top 0.254: LED1.A 48.56,9.96 48.56,11.38 R10.2 48.56,11.48 48.56,12.9 LED2.A
N$11  (via drill 0.3)
  Top 0.254: R9.1 37.69,3.76 37.69,1.42 37.59,1.32 JP11.1 | v33.83,8.74 36.37,11.28 37.08,11.28 U9.24
  Bottom 0.254: v33.83,8.74 33.83,6.71 37.59,2.95 JP11.1
N$12  (via drill 0.3)
  Top 0.254: v27.03,10.06 27.03,10.26 28.04,11.28 28.55,11.28 U9.1
  Bottom 0.254: v27.03,10.06 22.96,10.06 22.86,10.16 21.84,10.16 21.03,9.35 21.03,8.33 20.32,7.62 18.9,7.62 15.34,4.06 15.34,3.66 16.46,2.54 16.46,2.23 16.05,1.83 16.05,1.73 15.65,1.32 14.73,1.32 JP1.1
N$13  (via drill 0.3)
  Top 0.254: v28.96,3.66 29.46,4.17 30.07,4.17 U9.9
  Bottom 0.254: v28.96,3.66 23.98,3.66 22.86,2.54 18.49,2.54 17.27,1.32 JP1.2
N$14  (via drill 0.3)
  Top 0.254: v30.58,9.04 30.79,8.84 30.79,4.27 U9.10 | v18.39,9.25 18.39,2.74 19.81,1.32 JP1.3
  Bottom 0.254: v30.58,9.04 29.57,9.04 27.53,11.07 20.22,11.07 v18.39,9.25
N$15  (via drill 0.3)
  Top 0.254: v33.22,3.05 33.22,4.17 U9.13
  Bottom 0.254: v33.22,3.05 24.08,3.05 22.35,1.32 JP1.4
N$16
  Bottom 0.254: C13.2 42.98,24.18 44.4,24.18 U7.1
N$17
  Bottom 0.254: U7.9 44.91,20.12 44.91,21.03 44.7,21.23 44.2,21.23 43.99,21.03 43.99,19.1 44.6,18.49 48.16,18.49 48.46,18.8 JP5.3
N$18
  Bottom 0.254: IC5.4 41.15,9.45 42.06,9.45 43.59,10.97 43.59,11.07 43.89,11.38 44.7,11.38 J1.3
N$19
  Top 0.254: JP1.6 27.43,3.05 29.97,5.59 29.97,9.65 29.16,10.46 28.65,10.46 U9.2
N$20
  Top 0.254: U9.11 31.6,4.17 31.6,2.95 29.97,1.32 JP1.7
N$21
  Top 0.254: JP1.8 32.51,4.17 U9.12
N$22
  Top 0.254: U9.14 34.14,4.17 34.14,2.23 35.05,1.32 JP1.9
N$26
  Bottom 0.254: IC5.5 41.15,8.84 45.31,8.84 45.82,9.35 45.82,11.68 45.52,11.99 44.7,11.99 J1.2
N$30
  Bottom 0.254: JP5.4 47.35,21.23 46.23,21.23 46.02,21.03 46.02,20.12 U7.7
N$31
  pour Top (no thermals): 8.64,7.87 10.92,7.87 10.92,6.6 11.94,6.6 11.94,4.83 8.64,4.83
N$32  (via drill 0.3)
  Top 0.254: v41.45,14.33 45.82,9.96 46.94,9.96 LED1.C | v41.45,15.95 41.45,17.27 U4.1
  Bottom 0.254: v41.45,15.95 v41.45,14.33
N$33  (via drill 0.3)
  Top 0.254: v45.62,15.24 45.62,14.22 46.33,13.51 46.43,13.51 46.94,13.01 LED2.C | v43.18,19 42.47,19.71 42.47,20.22 U4.5
  Bottom 0.254: v45.62,15.24 45.62,16.56 v43.18,19
N$35
  Top 0.406: C6.2 5.2,7.99 5.08,7.87 5.5,7.87 U6.4
N$36
  Top 0.406: U6.6 7.32,9.84 C6.1
N$39
  Top 0.254: R3.1 C19.2 R4.2 13.65,3.81 U3.3
N$41
  Top 0.254: R11.1 14.94,9.45 14.53,9.45 13.72,8.64 U3.4
N$45
  Top 0.254: 10.26,33.02 10.26,30.68 10.06,30.48 D3.C | 10.26,33.02 10.26,33.53 Q2.2 | 10.26,33.02 16.05,33.02 17.27,31.8 JP3.4
RX  (via drill 0.3)
  Top 0.254: U9.30 31.7,12.8 31.7,14.43 32.11,14.83 32.21,14.83 v32.41,15.04 32.41,19.2 31.9,19.71 31.19,19.71 31.09,19.61 v30.79,19.61
  Bottom 0.254: v32.41,15.04 33.63,16.26 36.17,16.26 36.47,15.95 36.47,15.65 39.12,13.01 39.12,11.99 IC5.26 | JP2.P$3 19.81,33.53 21.13,32.21 21.13,29.26 23.27,27.13 23.27,23.27 26.42,20.12 30.28,20.12 v30.79,19.61
SCK  (via drill 0.3)
  Top 0.254: v31.39,7.21 31.6,7.42 33.73,7.42 35.36,5.79 37.08,5.79 U9.17
  Bottom 0.254: v31.39,7.21 23.16,7.21 22.35,6.4 JP9.3
SCL_3V  (via drill 0.3)
  Top 0.254: 42.77,28.55 42.77,27.13 v44.4,25.5 | 42.77,28.55 v42.77,28.96 | v26.21,17.68 26.21,22.76 25.3,23.67 25.3,26.62 U1.P$4 25.4,26.62 v26.72,26.62 | v32.72,11.68 33.22,12.19 33.22,12.7 U9.28 | v30.07,33.73 30.07,36.07 IC3.16 | 42.77,28.55 33.73,28.55 33.33,28.14 33.33,25.5 v33.53,25.3
  Bottom 0.254: v42.77,28.96 42.98,28.75 43.69,28.75 U2.SCK 43.94,28.92 43.94,29.97 44.7,30.73 46.74,30.73 47.49,31.49 U$1.A1 | v44.4,25.5 44.91,24.99 44.91,24.18 U7.2 | U8.2 27.53,17.68 v26.21,17.68 26.31,17.58 26.31,14.12 27.84,12.6 29.87,12.6 30.79,11.68 v32.72,11.68 | v30.07,33.73 30.07,29.97 29.11,29.01 | v26.72,26.62 29.11,29.01 | v33.53,25.3 32.82,25.3 29.11,29.01
SCL_5V
  Top 0.254: U1.P$1 25.2,28.25 23.88,28.25 20.42,31.7 19.81,31.7 JP3.3
SDA_3V  (via drill 0.3)
  Top 0.254: v34.04,13.92 34.04,12.8 U9.27 | 29.67,25.5 28.55,26.62 28.14,26.62 U1.P$5 | 29.67,25.5 31.8,25.5 32,25.7 32,29.57 | 32,29.57 32,35.46 31.39,36.07 IC3.15 | v45.11,25.91 45.11,27.53 43.08,29.57 32,29.57 | v27.43,16.26 27.43,23.16 29.67,25.4 29.67,25.5
  Bottom 0.254: v34.04,13.92 33.02,13.92 32.72,13.61 30.18,13.61 28.55,15.24 U8.1 27.94,15.75 v27.43,16.26 | 47.85,28.55 49.17,27.23 49.17,26.62 47.85,25.3 45.82,25.3 | 47.85,28.55 47.75,28.65 46.74,28.65 U2.DATA | 45.82,25.3 45.52,24.99 45.52,24.18 U7.3 | v45.11,25.91 45.72,25.3 45.82,25.3 | U$1.A2 47.76,29.96 48.26,29.46 48.26,28.96 47.85,28.55
SDA_5V
  Top 0.254: U1.P$8 28.04,28.25 27.03,28.25 25.5,29.77 24.28,29.77 22.35,31.7 JP3.2
TX  (via drill 0.3)
  Top 0.254: v35.46,11.68 33.63,11.68 33.02,11.07 32,11.07 30.94,12.14 | 30.94,12.14 30.89,12.19 30.89,12.7 U9.31 | JP2.P$2 22.35,33.53 23.67,32.21 23.67,31.19 24.69,30.18 26.01,30.18 v26.72,29.46 | v25.2,22.25 25.2,21.13 24.69,20.62 24.69,15.14 v25.7,14.12 | v29.87,11.68 30.48,11.68 30.94,12.14
  Bottom 0.254: IC5.25 38.61,12.5 38.41,12.7 36.47,12.7 v35.46,11.68 | v26.72,29.46 26.72,27.53 25.2,26.01 v25.2,22.25 | v25.7,14.12 28.14,11.68 v29.87,11.68
V_BATT  (via drill 0.3)
  Top 0.254: 42.27,14.94 41.55,14.94 40.13,16.36 37.39,16.36 36.37,17.37 Q1.3 36.37,17.48 36.37,19.91 v37.19,20.73 | 42.27,14.94 42.98,14.22 C2.1 | v48.87,25.4 48.67,25.4 47.95,26.11 46.53,26.11 S1.2 | v41.86,24.28 v47.14,24.28 | U4.3 43.28,17.27 43.28,16.05 42.27,15.04 42.27,14.94
  Bottom 0.254: v48.87,25.4 48.56,25.4 47.45,24.28 v47.14,24.28 | v41.86,24.28 40.44,25.7 40.44,25.81 40.13,26.11 38.91,26.11 37.19,24.38 v37.19,20.73
VCC  (via drill 0.3)
  Top 0.254: v47.14,20.42 48.67,21.95 48.67,22.86 49.17,23.37 v49.17,23.47 49.17,24.18 48.46,24.89 40.74,24.89 37.69,21.84 D2.C 35.46,21.84 35.46,19.61 Q1.2 35.26,19.61 v34.24,19.61 | C20.2 33.43,22.86 33.43,21.44 U5.1 33.43,21.34 33.43,20.93 32.92,20.42 32.72,20.42 | 32.72,20.42 29.97,20.42 SJ2.3 | v32.72,19.81 32.72,20.42
  Bottom 0.254: U7.10 44.5,20.02 44.5,19.2 44.81,18.9 46.13,18.9 46.43,19.2 46.43,20.02 U7.6 46.53,20.12 46.84,20.12 v47.14,20.42 | v49.17,23.47 48.77,23.06 47.45,23.06 46.53,23.98 46.53,24.08 U7.5 | JP4.1 22.25,16.76 23.77,18.29 30.99,18.29 32.51,19.81 v32.72,19.81 32.82,19.81 33.02,19.61 v34.24,19.61
VIN  (via drill 0.3)
  Top 0.254: C3.2 45.21,20.42 43.48,20.42 43.38,20.32 U4.4 43.48,20.52 43.48,21.03 42.27,22.25 42.27,23.27 41.96,23.57 41.05,23.57 39.73,22.25 39.73,21.95 D2.A 39.73,21.84 39.73,20.83 38.51,19.61 38.51,19.51 | 38.51,19.51 37.29,19.51 Q1.1 | 38.51,19.51 38.81,19.2 R14.2 38.91,19.1 v39.73,18.29 | v45.92,12.5 45.92,12.39 46.84,11.48 R10.1 | v40.34,5.38 40.34,6.4 v40.74,6.81 40.74,6.91 42.57,8.74 v42.57,11.38 42.57,11.48 40.74,13.31 v40.74,13.51 | v23.27,20.83 23.47,21.03 23.47,22.35 23.27,22.55 23.27,28.25 21.23,30.28 19.51,30.28 18.59,31.19 18.59,32.21 17.78,33.02 16.87,33.02 16.05,33.83 16.05,34.65 15.24,35.46 10.97,35.46 9.14,33.63 8.84,33.63 Q2.1 | v25.3,18.9 25.3,16.05 v27.23,14.12
  Top 0.813: D3.A 5.72,30.82 Q2.1
  Bottom 0.254: v45.92,12.5 45.72,12.5 45.52,12.7 44.7,12.7 J1.1 44.6,12.7 43.89,12.7 v42.57,11.38 | 40.39,7.16 41.05,7.82 IC5.7 | 40.39,7.16 40.13,6.91 IC5.8 | 40.03,5.08 40.03,4.37 C21.1 | v40.34,5.38 40.03,5.08 | 40.39,7.16 v40.74,6.81 | v23.27,20.83 25.2,18.9 v25.3,18.9 | v27.23,14.12 28.35,13.01 32.31,13.01 34.44,10.87 34.44,7.82 36.98,5.28 38.71,5.28 38.91,5.08 40.03,5.08 | v39.73,18.29 40.34,18.29 40.74,17.88 v40.74,13.51

### Text on the board
bNames: + / - / + / - | Design By Will Whang | IN-17 Controller | 2015 / 1